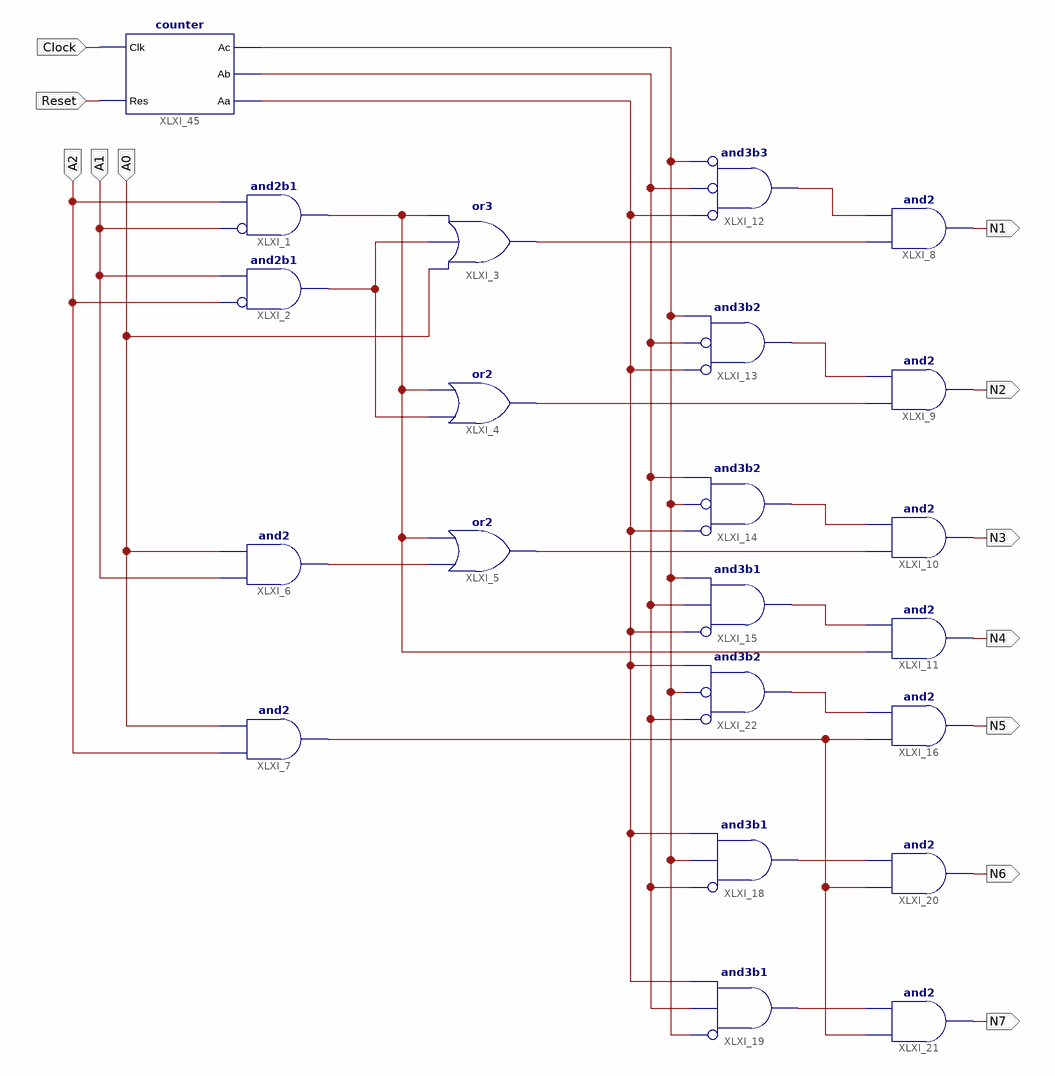
[diagram p0: schematic sheet 1]
// Xilinx ISE schematic anodeSelection.sch (xc9500xl) as structural Verilog: 22 symbols, 12 ports
module anodeSelection (
  input  A1,
  input  A2,
  input  A0,
  input  Clock,
  input  Reset,
  output N1,
  output N2,
  output N3,
  output N4,
  output N5,
  output N6,
  output N7
);

  wire XLXN_4, XLXN_5, XLXN_6, XLXN_9, XLXN_10, XLXN_11, XLXN_12, XLXN_13, XLXN_14, XLXN_22, XLXN_23,
       XLXN_24, XLXN_25, XLXN_26, XLXN_27, XLXN_28, XLXN_29;

  and XLXI_1 (XLXN_5, ~A1, A2);  // and2b1
  and XLXI_2 (XLXN_6, ~A2, A1);  // and2b1
  or XLXI_3 (XLXN_14, A0, XLXN_6, XLXN_5);
  or XLXI_4 (XLXN_13, XLXN_6, XLXN_5);
  or XLXI_5 (XLXN_12, XLXN_4, XLXN_5);
  and XLXI_6 (XLXN_4, A1, A0);
  and XLXI_8 (N1, XLXN_14, XLXN_23);
  and XLXI_9 (N2, XLXN_13, XLXN_24);
  and XLXI_10 (N3, XLXN_12, XLXN_25);
  and XLXI_11 (N4, XLXN_5, XLXN_26);
  and XLXI_12 (XLXN_23, ~XLXN_9, ~XLXN_10, ~XLXN_11);  // and3b3
  and XLXI_13 (XLXN_24, ~XLXN_9, ~XLXN_10, XLXN_11);  // and3b2
  and XLXI_15 (XLXN_26, ~XLXN_9, XLXN_10, XLXN_11);  // and3b1
  and XLXI_7 (XLXN_29, A2, A0);
  and XLXI_16 (N5, XLXN_29, XLXN_27);
  and XLXI_14 (XLXN_25, ~XLXN_9, ~XLXN_11, XLXN_10);  // and3b2
  and XLXI_19 (XLXN_22, ~XLXN_11, XLXN_10, XLXN_9);  // and3b1
  and XLXI_20 (N6, XLXN_29, XLXN_28);
  and XLXI_21 (N7, XLXN_29, XLXN_22);
  and XLXI_18 (XLXN_28, ~XLXN_10, XLXN_11, XLXN_9);  // and3b1
  and XLXI_22 (XLXN_27, ~XLXN_10, ~XLXN_11, XLXN_9);  // and3b2
  counter XLXI_45 (.Clk(Clock), .Res(Reset), .Ac(XLXN_11), .Ab(XLXN_10), .Aa(XLXN_9));
endmodule
